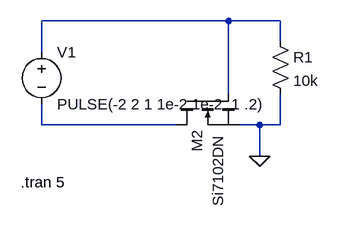
[diagram p0: schematic polarityprotection_nchannel.asc]
polarityprotection_nchannel.asc, the LTspice schematic file:
Version 4
SHEET 1 880 680
WIRE 176 48 -112 48
WIRE 256 48 176 48
WIRE 256 80 256 48
WIRE -112 96 -112 48
WIRE 176 160 176 48
WIRE -112 208 -112 176
WIRE 96 208 -112 208
WIRE 224 208 192 208
WIRE 256 208 256 160
WIRE 256 208 224 208
WIRE 224 256 224 208
FLAG 224 256 0
SYMBOL voltage -112 80 R0
WINDOW 123 0 0 Left 2
WINDOW 39 0 0 Left 2
SYMATTR InstName V1
SYMATTR Value PULSE(-2 2 1 1e-2 1e-2 .1 .2)
SYMBOL res 240 64 R0
SYMATTR InstName R1
SYMATTR Value 10k
SYMBOL nmos 96 160 M90
WINDOW 3 64 64 Left 2
SYMATTR Value Si7102DN
SYMATTR InstName M2
TEXT -144 296 Left 2 !.tran 5

The netlist it stands for:
* polarityprotection_nchannel.asc
V1 N001 N002 PULSE(-2 2 1 1e-2 1e-2 .1 .2)
R1 N001 0 10k
M2 N002 N001 0 0 Si7102DN
.model NMOS NMOS
.model PMOS PMOS
.lib standard.mos
.tran 5
.backanno
.end